# EAGLE design Project2 (EAGLE 9.6.2)
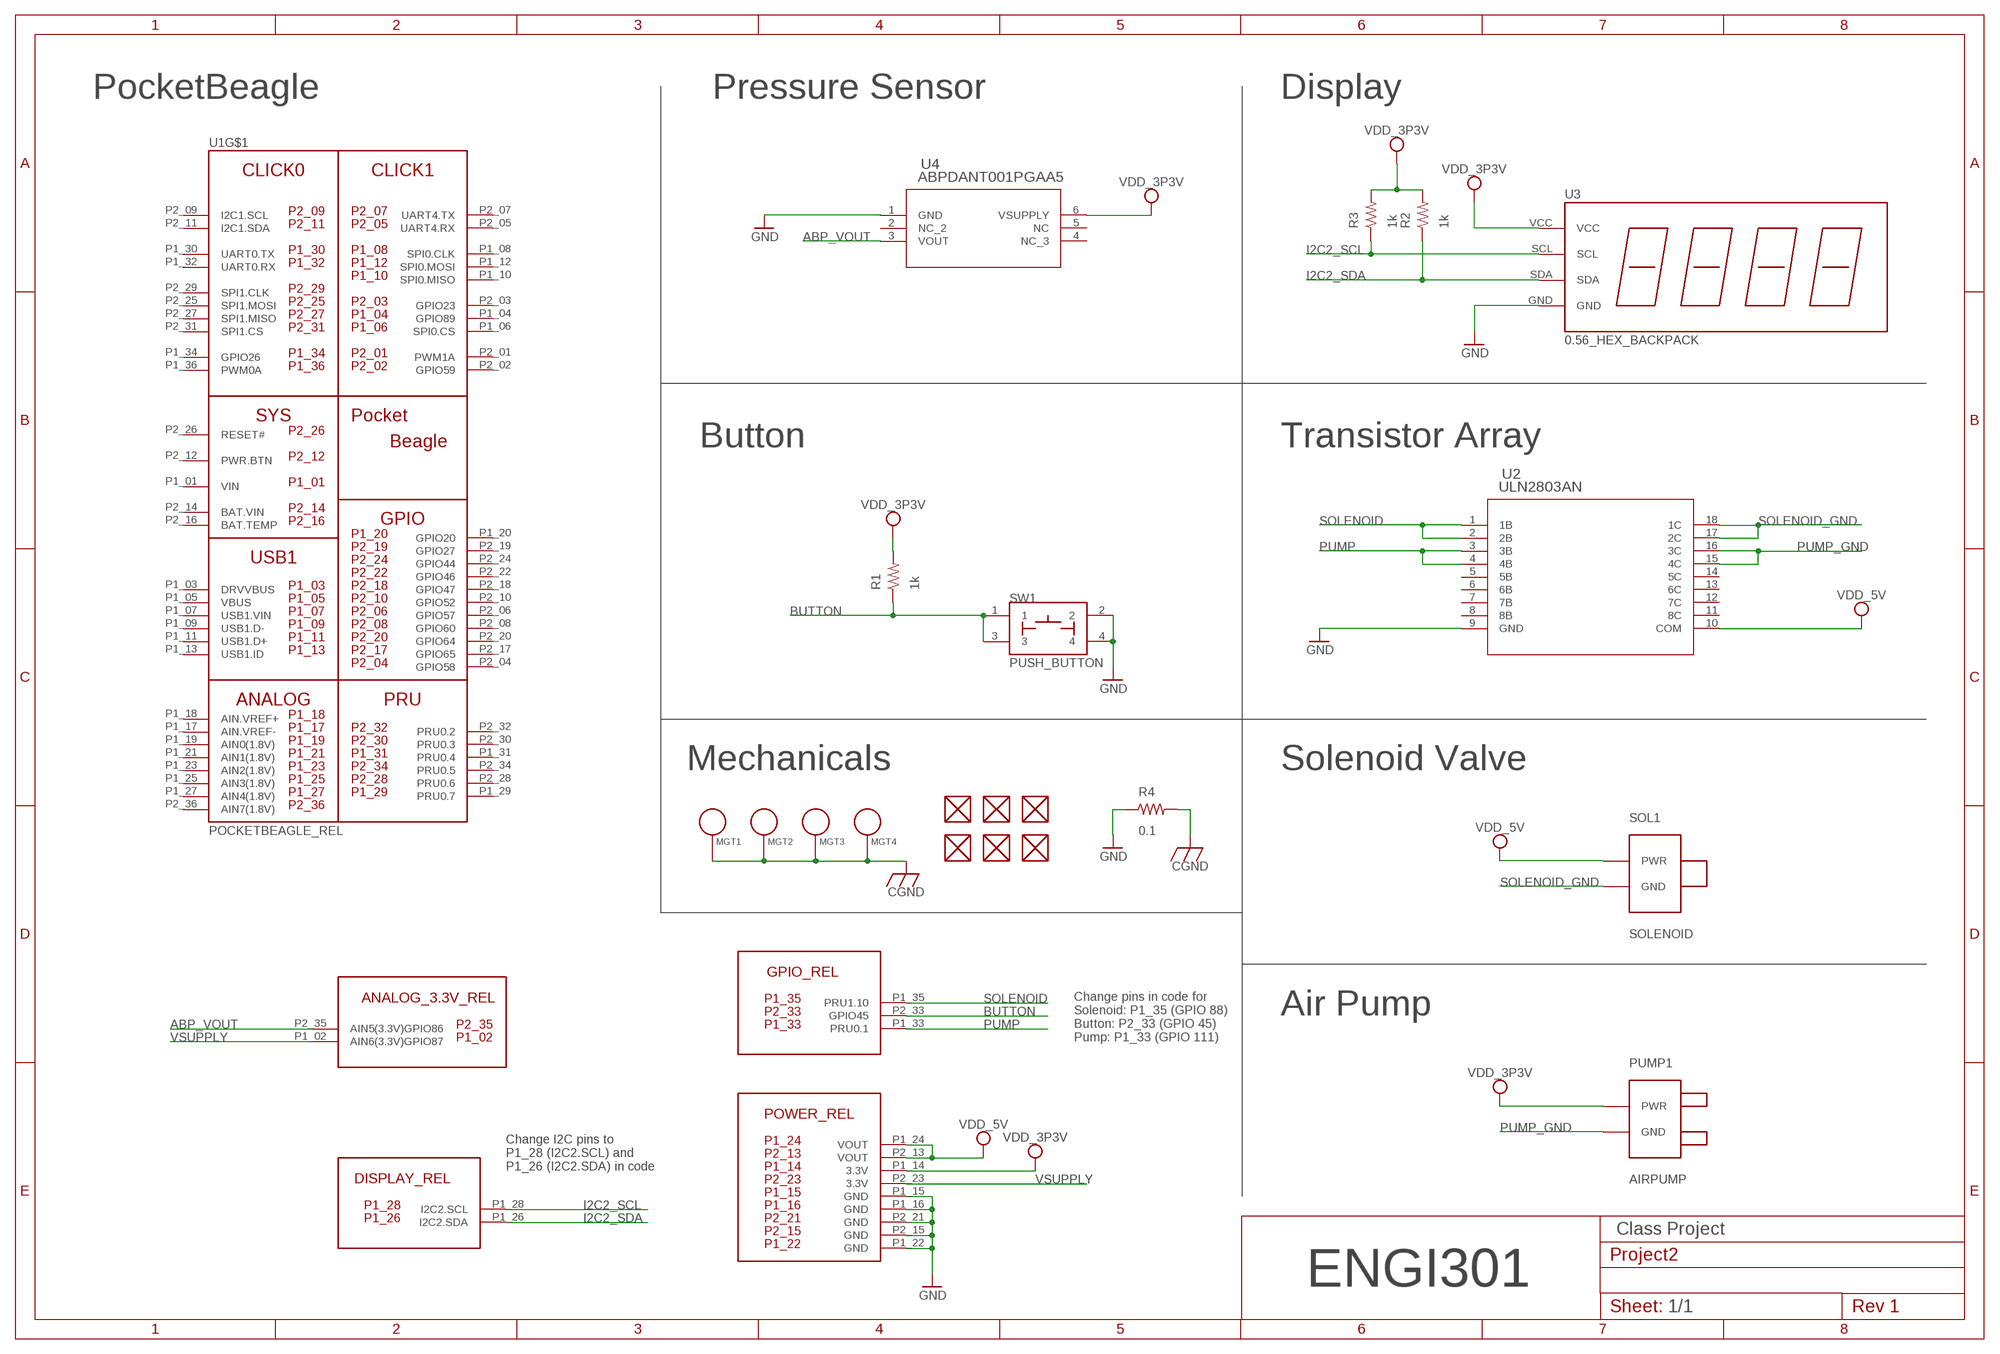
[diagram p0: schematic, sheet 1]

## Parts
FUD1  FIDUCIAL  [FIDUCIAL_40MIL]
FUD2  FIDUCIAL  [FIDUCIAL_40MIL]
FUD3  FIDUCIAL  [FIDUCIAL_40MIL]
FUD4  FIDUCIAL  [FIDUCIAL_40MIL]
FUD5  FIDUCIAL  [FIDUCIAL_40MIL]
FUD6  FIDUCIAL  [FIDUCIAL_40MIL]
MGT1  MOUNTING_HOLE  [MOUNTING_HOLE]
MGT2  MOUNTING_HOLE  [MOUNTING_HOLE]
MGT3  MOUNTING_HOLE  [MOUNTING_HOLE]
MGT4  MOUNTING_HOLE  [MOUNTING_HOLE]
PUMP1  AIRPUMP  [AIRPUMP]
R1  1k  R_R0603  [R0603]
R2  1k  R_R0603  [R0603]
R3  1k  R_R0603  [R0603]
R4  0.1  R_R0603  [R0603]
SOL1  SOLENOID  [SOLENOID]
SW1  PUSH_BUTTON  [BUTTON_12.5MM]
U1  POCKETBEAGLE_REL  [POCKETBEAGLE]
U2  ULN2803AN  [N18_TEX]
U3  0.56_HEX_BACKPACK  [0.56_HEX_BACKPACK]
U4  ABPDANT001PGAA5  [ABPDAN_HNW]

## Nets
ABP_VOUT: U1.P2_35(AIN5(3.3V)GPIO86) U4.3(VOUT)
BUTTON: R1.1 SW1.1 SW1.3 U1.P2_33(GPIO45)
CGND: MGT1.P$1 MGT2.P$1 MGT3.P$1 MGT4.P$1 R4.2
GND: R4.1 SW1.2 SW1.4 U1.P1_15(GND) U1.P1_16(GND) U1.P1_22(GND) U1.P2_15(GND) U1.P2_21(GND) U2.9(GND) U3.GND U4.1(GND)
I2C2_SCL: R3.1 U1.P1_28(I2C2.SCL) U3.SCL
I2C2_SDA: R2.1 U1.P1_26(I2C2.SDA) U3.SDA
PUMP: U1.P1_33(PRU0.1) U2.3(3B) U2.4(4B)
PUMP_GND: PUMP1.GND1(GND) U2.15(4C) U2.16(3C)
SOLENOID: U1.P1_35(PRU1.10) U2.1(1B) U2.2(2B)
SOLENOID_GND: SOL1.GND U2.17(2C) U2.18(1C)
VDD_3P3V: PUMP1.PWR1(PWR) R1.2 R2.2 R3.2 U1.P1_14(3.3V) U3.VCC U4.6(VSUPPLY)
VDD_5V: SOL1.PWR1(PWR) U1.P1_24(VOUT) U1.P2_13(VOUT) U2.10(COM)
VSUPPLY: U1.P1_02(AIN6(3.3V)GPIO87) U1.P2_23(3.3V)
Unconnected: FUD1.P$1 FUD2.P$1 FUD3.P$1 FUD4.P$1 FUD5.P$1 FUD6.P$1 U1.P1_03(DRVVBUS) U1.P1_04(GPIO89) U1.P1_05(VBUS) U1.P1_06(SPI0.CS) U1.P1_07(USB1.VIN) U1.P1_08(SPI0.CLK) U1.P1_09(USB1.D-) U1.P1_10(SPI0.MISO) U1.P1_11(USB1.D+) U1.P1_12(SPI0.MOSI) U1.P1_13(USB1.ID) U1.P1_17(AIN.VREF-) U1.P1_18(AIN.VREF+) U1.P1_19(AIN0(1.8V)) U1.P1_20(GPIO20) U1.P1_21(AIN1(1.8V)) U1.P1_23(AIN2(1.8V)) U1.P1_25(AIN3(1.8V)) U1.P1_27(AIN4(1.8V)) U1.P1_29(PRU0.7) U1.P1_30(UART0.TX) U1.P1_31(PRU0.4) U1.P1_32(UART0.RX) U1.P1_34(GPIO26) U1.P1_36(PWM0A) U1.P2_01(PWM1A) U1.P2_02(GPIO59) U1.P2_03(GPIO23) U1.P2_04(GPIO58) U1.P2_05(UART4.RX) U1.P2_06(GPIO57) U1.P2_07(UART4.TX) U1.P2_08(GPIO60) U1.P2_09(I2C1.SCL) U1.P2_10(GPIO52) U1.P2_11(I2C1.SDA) U1.P2_12(PWR.BTN) U1.P2_16(BAT.TEMP) U1.P2_17(GPIO65) U1.P2_18(GPIO47) U1.P2_19(GPIO27) U1.P2_20(GPIO64) U1.P2_22(GPIO46) U1.P2_24(GPIO44) U1.P2_25(SPI1.MOSI) U1.P2_26(RESET#) U1.P2_27(SPI1.MISO) U1.P2_28(PRU0.6) U1.P2_29(SPI1.CLK) U1.P2_30(PRU0.3) U1.P2_31(SPI1.CS) U1.P2_32(PRU0.2) U1.P2_34(PRU0.5) U1.P2_36(AIN7(1.8V)) U2.5(5B) U2.6(6B) U2.7(7B) U2.8(8B) U2.11(8C) U2.12(7C) U2.13(6C) U2.14(5C) U4.2(NC_2) U4.4(NC_3) U4.5(NC)

## Notes on the sheet
- PocketBeagle | Pressure Sensor | Display
- Button | Transistor Array
- Mechanicals | Solenoid Valve
- Air Pump
- Change pins in code for
  Solenoid: P1_35 (GPIO 88)
  Button: P2_33 (GPIO 45)
  Pump: P1_33 (GPIO 111)
- Change I2C pins to
  P1_28 (I2C2.SCL) and
  P1_26 (I2C2.SDA) in code
- Class Project
- ENGI301
- 1/1

## Power pins joined to a net without a drawn wire
BAT.VIN: U1.P2_14(BAT.VIN)
VIN: U1.P1_01(VIN)

## Library data of the parts
FUD1-FUD6 = project_2:FIDUCIAL
MGT1-MGT4 = project_2:MOUNTING_HOLE: Chassis Mounting Hole w/GND connection ability
PUMP1 = project_2:AIRPUMP: AIMELIAE 1PCS DC 3V Micro Vacuum Air Pump Mini Air Pressure Pump Medical Pump 30KPa 0.28L - Available at: https://www.amazon.com/AIMELIAE-Micro-Vacuum-Pressure-Medical/dp/B074T95GGX/ref=sr_1_3?dchild=1&keywords=micro+medical+air+pump&qid=1633015002&sr=8-3
R1-R4 = project_2:R_: RESISTOR, American symbol
SOL1 = project_2:SOLENOID: Uxcell Miniature Solenoid Valve 2 Way Normally Closed DC4.5V 0.5A Air Solenoid Valve - Available at: https://www.amazon.com/uxcell-Miniature-Solenoid-Normally-Closed/dp/B07WR8S4S1/ref=sr_1_5?dchild=1&keywords=5v+gas+solenoid+valve&qid=1633098333&refinements=p_85%3A2470955011&rnid=2470954011&rps=1&s=industrial&sr=1-5#descriptionAndDetails
SW1 = project_2:PUSH_BUTTON
U1 = project_2:POCKETBEAGLE_REL: A PocketBeagle device with relevant components for the Stress Buddy project separated from the main schematic.
U2 = project_2:ULN2803AN; COPYRIGHT: Copyright (C) 2021 Ultra Librarian. All rights reserved.; MANUFACTURER_PART_NUMBER: ULN2803AN; MFR_NAME: Texas Instruments
U3 = project_2:0.56_HEX_BACKPACK: 0.56" LED HEX Backback - Adafruit HT16K33 - https://www.adafruit.com/product/878 - https://www.adafruit.com/product/879 - https://www.adafruit.com/product/880 - https://www.adafruit.com/product/881 - https://www.adafruit.com/product/1002
U4 = project_2:ABPDANT001PGAA5; COPYRIGHT: Copyright (C) 2021 Ultra Librarian. All rights reserved.; MANUFACTURER_PART_NUMBER: ABPDANT005PGAA5; MFR_NAME: Honeywell

## Board
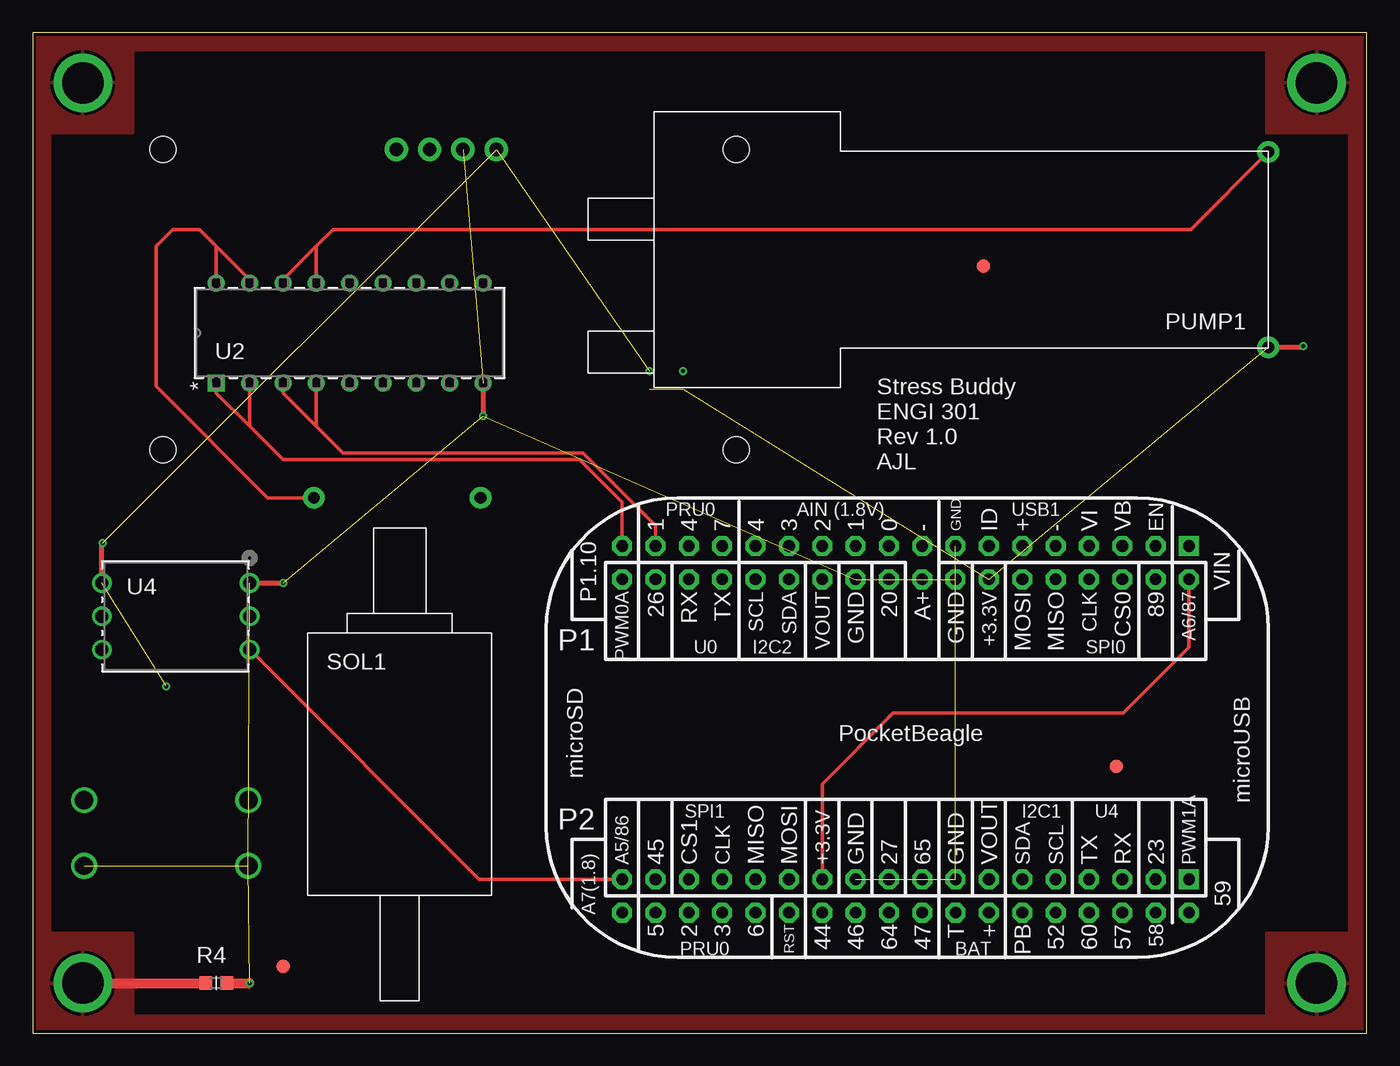
[diagram p1: board, top side]
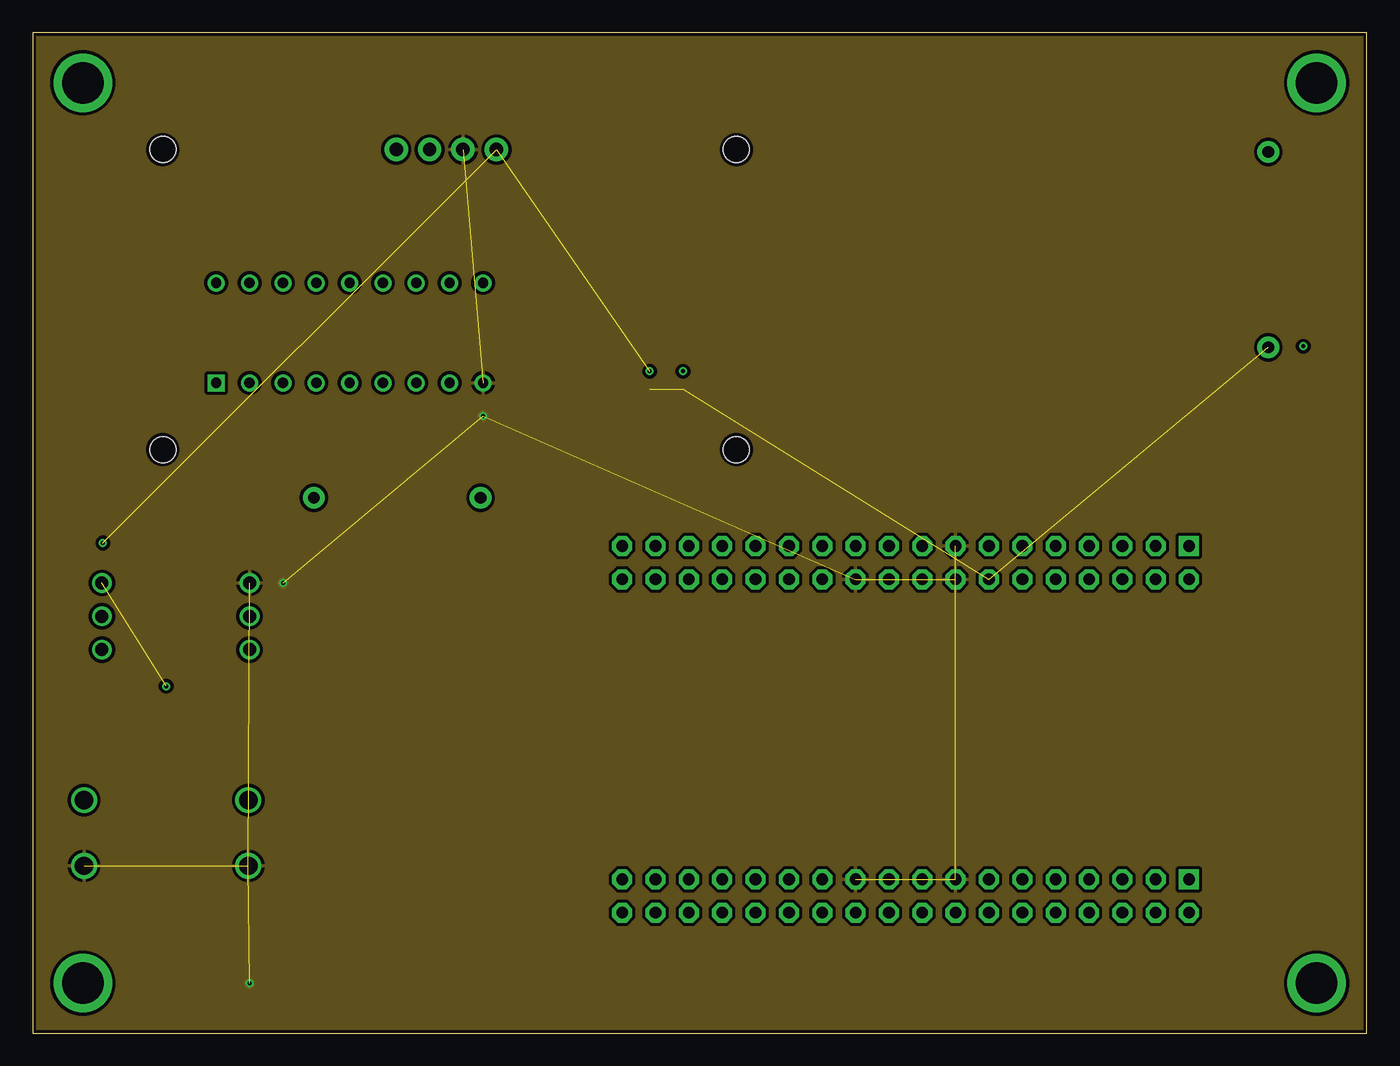
[diagram p2: board, inner layer Route2]
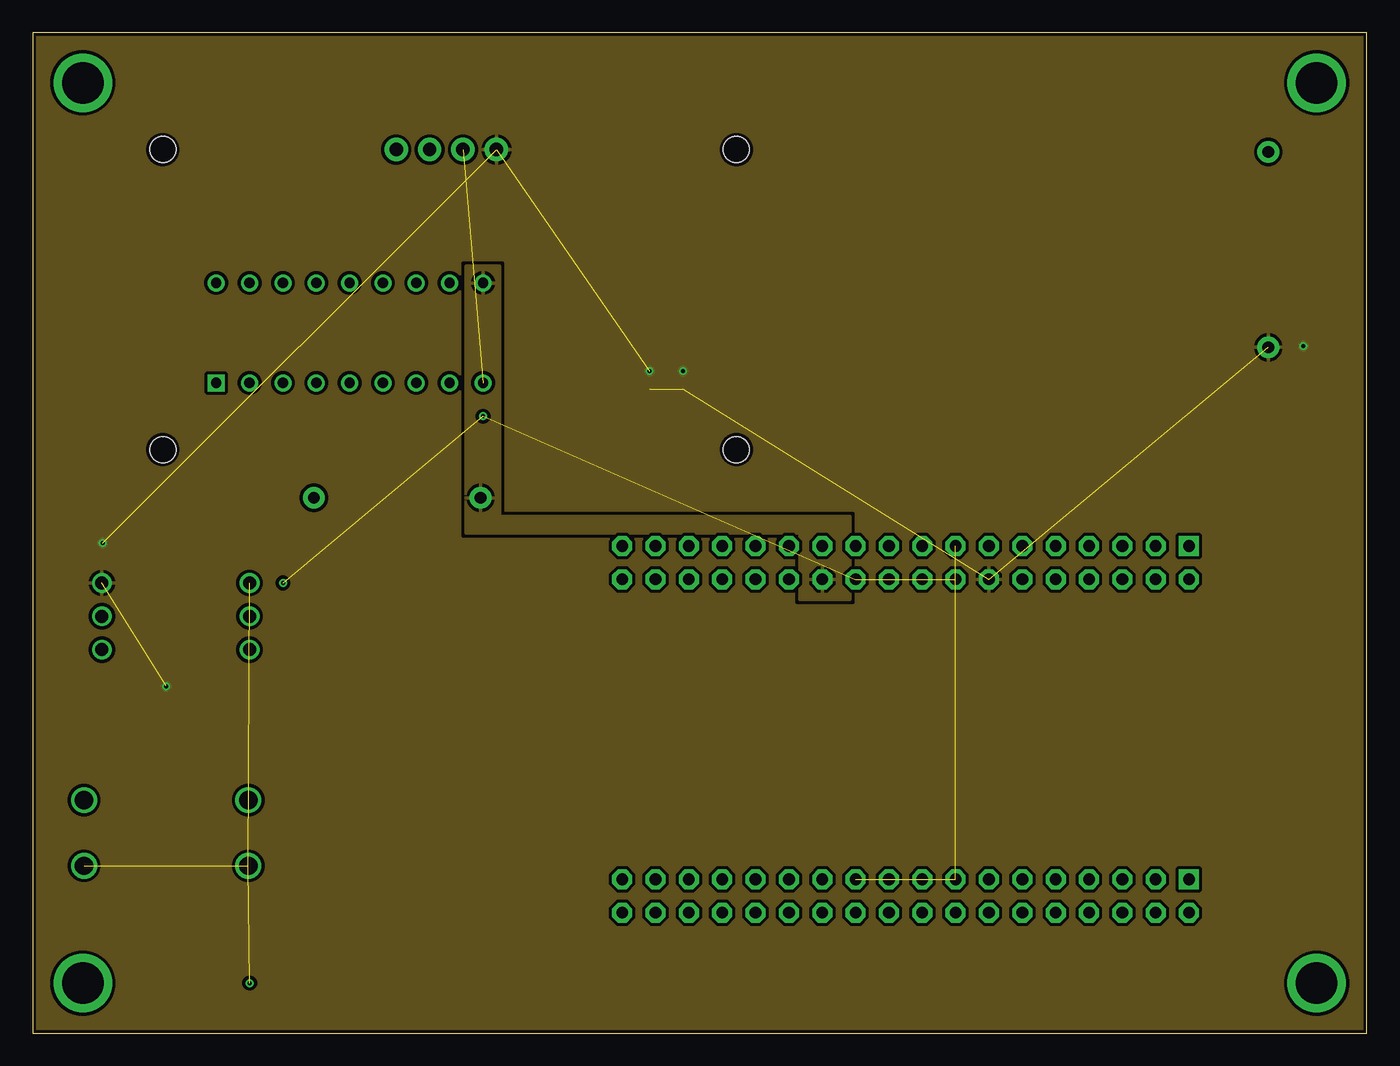
[diagram p3: board, inner layer Route15]
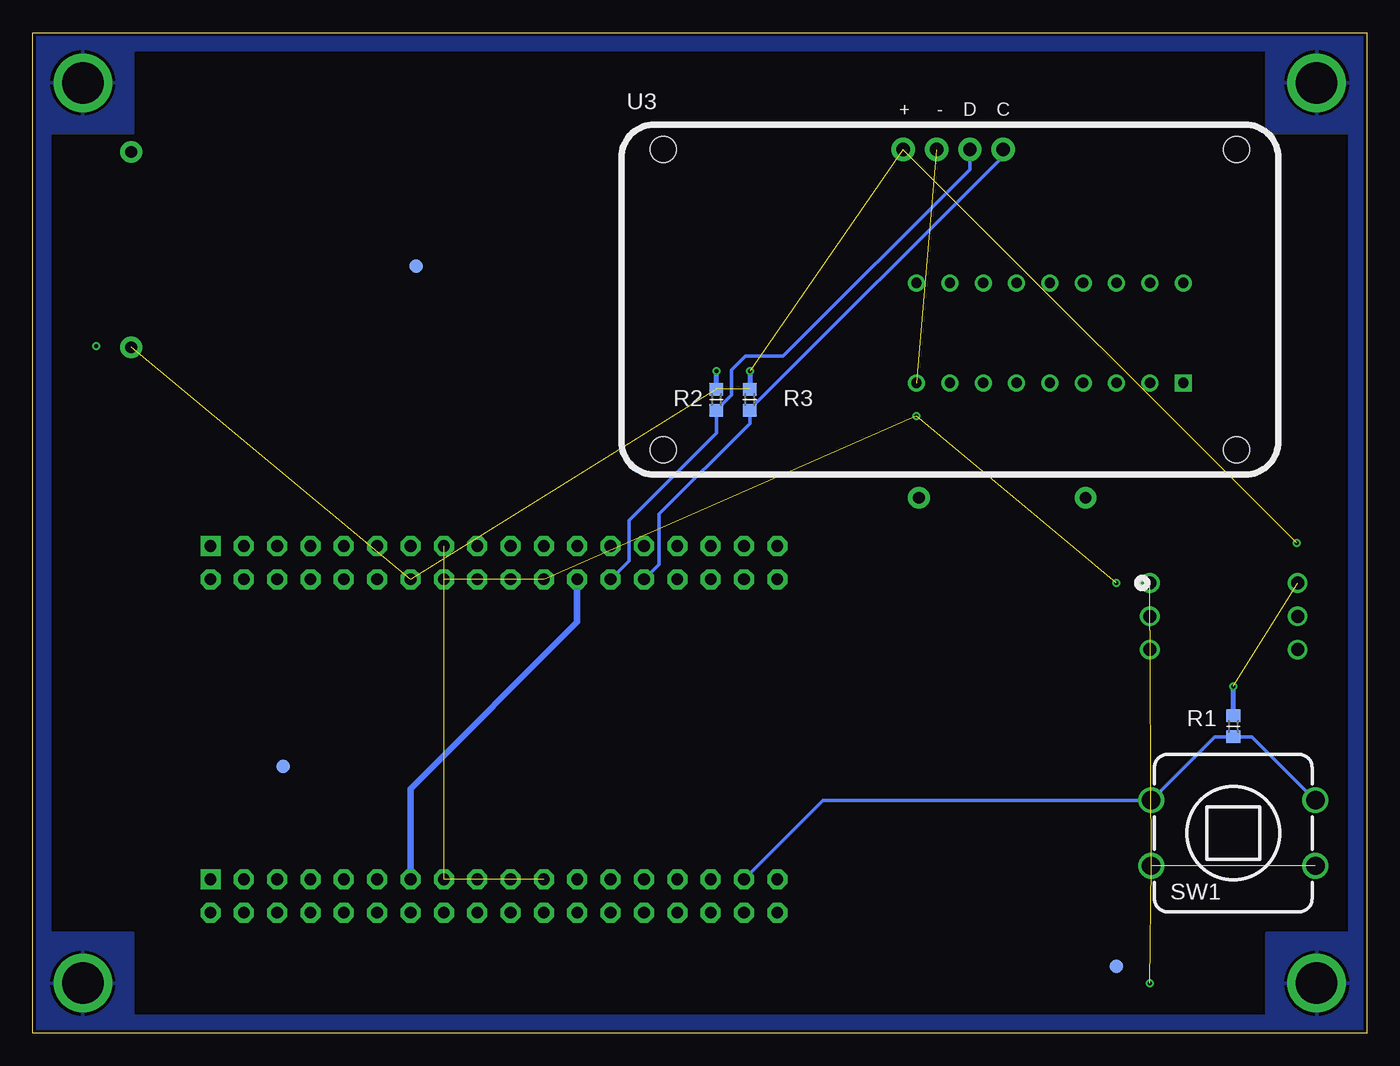
[diagram p4: board, bottom side, seen from below]

Size 101.6 x 76.2 mm. Coordinates in mm from the lower left corner, seen from the top.
Outline: 0,0 101.6,0 101.6,76.2 0,76.2 0,0
Copper layers (1*2*15*16): Top 0.035mm / dielectric 0.23mm / Route2 0.035mm / dielectric 0.93mm / Route15 0.035mm / dielectric 0.23mm / Bottom 0.035mm
Design rules "ENGI301_4lyr": minimum track width 10mil, minimum drill 12mil, track to track 10mil, track to pad 10mil, pad to pad 10mil, via to via 10mil, smd to smd 10mil, copper to edge 10mil, drill to drill 12mil, minimum pad ring 6mil, minimum via ring 6mil, stop-mask expansion 3mil, vias tented up to drill 25mil, thermal gap 10mil

### Footprints (pad centres in the part's own frame; a part is rotated, then mirrored left to right if it is on the bottom)
FIDUCIAL_40MIL = smd 1.016 x 1.016: P$1 0,0
MOUNTING_HOLE = drill 3.175 pad 4.445: P$1 0,0
AIRPUMP = drill 0.889 pad 1.651: GND1 -7.44,1.4; PWR1 7.44,1.4
R0603 = smd 0.95 x 1.031: 1 -0.8,0; 2 0.8,0
SOLENOID = drill 0.889 pad 1.651: GND -6.53,10.29; PWR1 6.17,10.29
BUTTON_12.5MM = drill 1.4: 1 -6.25,2.5; 2 -6.25,-2.5; 3 6.25,2.5; 4 6.25,-2.5
POCKETBEAGLE = drill 0.889 pad 1.524 square: P1_01 5.91,3.53; P2_01 5.91,28.93 | drill 0.889 pad 1.524 octagon: P1_02 5.91,6.07; P1_03 8.45,3.53; P1_04 8.45,6.07; P1_05 10.99,3.53; P1_06 10.99,6.07; P1_07 13.53,3.53; P1_08 13.53,6.07; P1_09 16.07,3.53; P1_10 16.07,6.07; P1_11 18.61,3.53; P1_12 18.61,6.07; P1_13 21.15,3.53; P1_14 21.15,6.07; P1_15 23.69,3.53; P1_16 23.69,6.07; P1_17 26.23,3.53; P1_18 26.23,6.07; P1_19 28.77,3.53; P1_20 28.77,6.07; P1_21 31.31,3.53; P1_22 31.31,6.07; P1_23 33.85,3.53; P1_24 33.85,6.07; P1_25 36.39,3.53; P1_26 36.39,6.07; P1_27 38.93,3.53; P1_28 38.93,6.07; P1_29 41.47,3.53; P1_30 41.47,6.07; P1_31 44.01,3.53; P1_32 44.01,6.07; P1_33 46.55,3.53; P1_34 46.55,6.07; P1_35 49.09,3.53; P1_36 49.09,6.07; P2_02 5.91,31.47; P2_03 8.45,28.93; P2_04 8.45,31.47; P2_05 10.99,28.93; P2_06 10.99,31.47; P2_07 13.53,28.93; P2_08 13.53,31.47; P2_09 16.07,28.93; P2_10 16.07,31.47; P2_11 18.61,28.93; P2_12 18.61,31.47; P2_13 21.15,28.93; P2_14 21.15,31.47; P2_15 23.69,28.93; P2_16 23.69,31.47; P2_17 26.23,28.93; P2_18 26.23,31.47; P2_19 28.77,28.93; P2_20 28.77,31.47; P2_21 31.31,28.93; P2_22 31.31,31.47; P2_23 33.85,28.93; P2_24 33.85,31.47; P2_25 36.39,28.93; P2_26 36.39,31.47; P2_27 38.93,28.93; P2_28 38.93,31.47; P2_29 41.47,28.93; P2_30 41.47,31.47; P2_31 44.01,28.93; P2_32 44.01,31.47; P2_33 46.55,28.93; P2_34 46.55,31.47; P2_35 49.09,28.93; P2_36 49.09,31.47
N18_TEX = drill 0.787 pad 1.295 square: 1 0,0 | drill 0.787 pad 1.295: 2 0,-2.54; 3 0,-5.08; 4 0,-7.62; 5 0,-10.16; 6 0,-12.7; 7 0,-15.24; 8 0,-17.78; 9 0,-20.32; 10 7.62,-20.32; 11 7.62,-17.78; 12 7.62,-15.24; 13 7.62,-12.7; 14 7.62,-10.16; 15 7.62,-7.62; 16 7.62,-5.08; 17 7.62,-2.54; 18 7.62,0
0.56_HEX_BACKPACK = drill 1.016 pad 1.778: GND -1.016,11.43; SCL 4.064,11.43; SDA 1.524,11.43; VCC -3.556,11.43 | hole 2: -21.844,-11.43; 21.844,-11.43; -21.844,11.43; 21.844,11.43
ABPDAN_HNW = drill 0.991 pad 1.499: 1 0,0; 2 0,-2.54; 3 0,-5.08; 4 -11.252,-5.08; 5 -11.252,-2.54; 6 -11.252,0

### Placement (x,y rotation side)
FUD1  19.05,5.08 0 top
FUD2  82.55,20.32 0 top
FUD3  72.39,58.42 0 bottom
FUD4  19.05,5.08 0 bottom
FUD5  72.39,58.42 0 top
FUD6  82.55,20.32 0 bottom
MGT1  3.81,3.81 0 top
MGT2  97.79,72.39 0 top
MGT3  3.81,72.39 0 top
MGT4  97.79,3.81 0 top
PUMP1  92.71,59.69 270 top
R1  10.16,23.37 90 bottom
R2  49.53,48.26 90 bottom
R3  46.99,48.26 90 bottom
R4  13.97,3.81 180 top
SOL1  27.94,30.48 0 top
SW1  10.16,15.24 0 bottom
U1  93.98,40.64 180 top
U2  13.97,49.53 90 top
U3  31.75,55.88 0 bottom
U4  16.51,34.29 0 top

### Tracks (layer width: path | path; a pad name or v marks a point on that pad's centre or on a via)
ABP_VOUT
  Top 0.254: U4.3 34.01,11.71 U1.P2_35
BUTTON
  Bottom 0.254: U1.P2_33 41.4,17.74 SW1.1 11.58,22.57 R1.1 8.74,22.57 SW1.3
CGND
  Top 0.762: MGT1.P$1 R4.2
  pour Top: -1.27,38.1 -1.27,77.47 102.87,77.47 102.87,38.1 100.33,38.1 100.33,68.58 93.98,68.58 93.98,74.93 8.89,74.93 7.62,74.93 7.62,68.58 1.27,68.58 1.27,38.1
  pour Top: -1.27,38.1 -1.27,-1.27 102.87,-1.27 102.87,38.1 100.33,38.1 100.33,7.62 93.98,7.62 93.98,1.27 7.62,1.27 7.62,7.62 1.27,7.62 1.27,38.1
  pour Bottom: -1.27,38.1 -1.27,77.47 102.87,77.47 102.87,38.1 100.33,38.1 100.33,68.58 93.98,68.58 93.98,74.93 7.62,74.93 7.62,68.58 1.27,68.58 1.27,38.1
  pour Bottom: -1.27,38.1 -1.27,-1.27 102.87,-1.27 102.87,38.1 100.33,38.1 100.33,7.62 93.98,7.62 93.98,1.27 7.62,1.27 7.62,7.62 1.27,7.62 1.27,38.1
GND  (via drill 0.3 pad 0.61)  (10 unrouted)
  Top 0.381: U2.9 v34.29,46.99 | U4.1 v19.05,34.29
  Top 0.762: R4.1 v16.51,3.81
  pour Route2: -2.54,0 -2.54,78.74 104.14,78.74 104.14,-2.54 -2.54,-2.54
I2C2_SCL
  Bottom 0.254: U3.SCL 27.69,66.8 46.74,47.75 46.74,47.46 R3.1 46.99,46.44 53.91,39.53 53.91,35.71 U1.P1_28
I2C2_SDA
  Bottom 0.254: U1.P1_26 56.19,35.97 56.19,39.06 49.53,45.72 R2.1 48.38,48.61 48.38,50.51 47.33,51.56 44.45,51.56 30.23,65.79 U3.SDA
PUMP
  Top 0.254: U2.4 21.59,46.23 | 21.59,46.23 23.62,44.2 41.91,44.2 47.43,38.68 U1.P1_33 | 21.59,46.23 19.05,48.77 U2.3
PUMP_GND
  Top 0.254: U2.15 21.59,59.94 | 21.59,59.94 22.86,61.21 88.19,61.21 PUMP1.GND1 | 21.59,59.94 19.05,57.4 U2.16
SOLENOID
  Top 0.254: U2.2 16.51,46.23 | 16.51,46.23 19.05,43.69 41.66,43.69 44.89,40.45 U1.P1_35 | 16.51,46.23 13.97,48.77 U2.1
SOLENOID_GND
  Top 0.254: U2.18 13.97,59.94 | 13.97,59.94 12.7,61.21 10.67,61.21 9.4,59.94 9.4,49.28 17.9,40.77 SOL1.GND | 13.97,59.94 16.51,57.4 U2.17
VDD_3P3V  (via drill 0.3 pad 0.61)  (6 unrouted)
  Top 0.254: 5.26,37.26 v5.33,37.34
  Top 0.381: U4.6 5.26,37.26 | PUMP1.PWR1 96.7,52.25 v96.77,52.32
  Bottom 0.254: v10.16,26.42 10.16,26.45
  Bottom 0.381: v46.99,50.42 R3.2 | R2.2 v49.53,50.42 | R1.2 v10.16,26.42
  pour Route15 (rank 6): -5.08,-5.08 -5.08,81.28 106.68,81.28 106.68,-5.08
VDD_5V
  Bottom 0.508: U1.P1_24 60.13,31.31 72.83,18.61 U1.P2_13
  pour Route15: 58.42,33.02 62.23,33.02 62.23,39.37 36.83,39.37 35.56,39.37 35.56,58.42 33.02,58.42 33.02,38.1 58.42,38.1
VSUPPLY
  Top 0.254: U1.P2_23 60.13,18.98 65.53,24.38 83.06,24.38 88.07,29.4 U1.P1_02

### Text on the board
tPlace: Stress Buddy / ENGI 301 / Rev 1.0 / AJL